# Altium schematic sheet Auxiliary.SchDoc: Auxiliary Components
size A4; DocumentNumber: 3; SheetNumber: 3; SheetTotal: 4
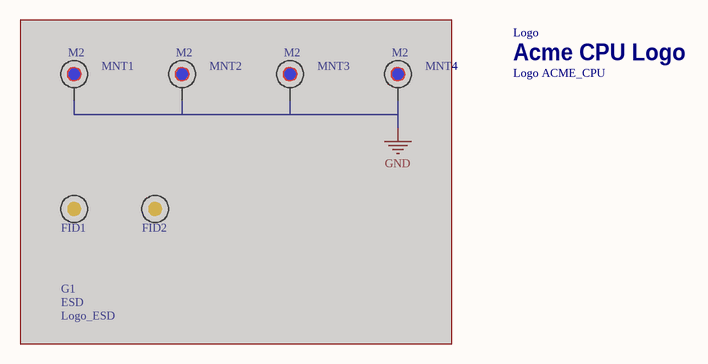
[diagram p0: Auxiliary.SchDoc]

## Parts
FID1  N/A  [Fiducial]  (value not drawn)  (no BOM)  (masked out: inside a compile mask, not in the netlist)
FID2  N/A  [Fiducial]  (value not drawn)  (no BOM)  (masked out: inside a compile mask, not in the netlist)
G1  Logo_ESD  [Logo_ESD]  (no BOM)  (masked out: inside a compile mask, not in the netlist)
Logo  Logo ACME_CPU  [LOGO_ACME_CPU]  (no BOM)
MNT1  MountHole M2. Nothing to buy or mount  [MountHole_M2]  (value not drawn)  (no BOM)  (masked out: inside a compile mask, not in the netlist)
MNT2  MountHole M2. Nothing to buy or mount  [MountHole_M2]  (value not drawn)  (no BOM)  (masked out: inside a compile mask, not in the netlist)
MNT3  MountHole M2. Nothing to buy or mount  [MountHole_M2]  (value not drawn)  (no BOM)  (masked out: inside a compile mask, not in the netlist)
MNT4  MountHole M2. Nothing to buy or mount  [MountHole_M2]  (value not drawn)  (no BOM)  (masked out: inside a compile mask, not in the netlist)

## Notes on the sheet
- Title
- Size:
- Date:
- A4
- Number:
- Time:
- Revision:
- Sheet
- of
- File:
- (in symbol Logo ACME_CPU) Acme CPU Logo
- (in symbol Logo_ESD) ESD
- (in symbol MountHole_M2) M2

## Library data of the parts
FID1 FID2 = Fiducial: Fiducial mark.  There is nothing to buy or mount.; ClassName: FiducialMark; CompType: Fiducial; Manufacturer: N/A; MountType: N/A; PackageReference: Fiducial; Manufacturer Part Number: N/A
MNT1-MNT4 = MountHole_M2: PCB Mount Hole. There is nothing to buy or mount.
Logo = Logo ACME_CPU: ClassName: PCB_FEATURE